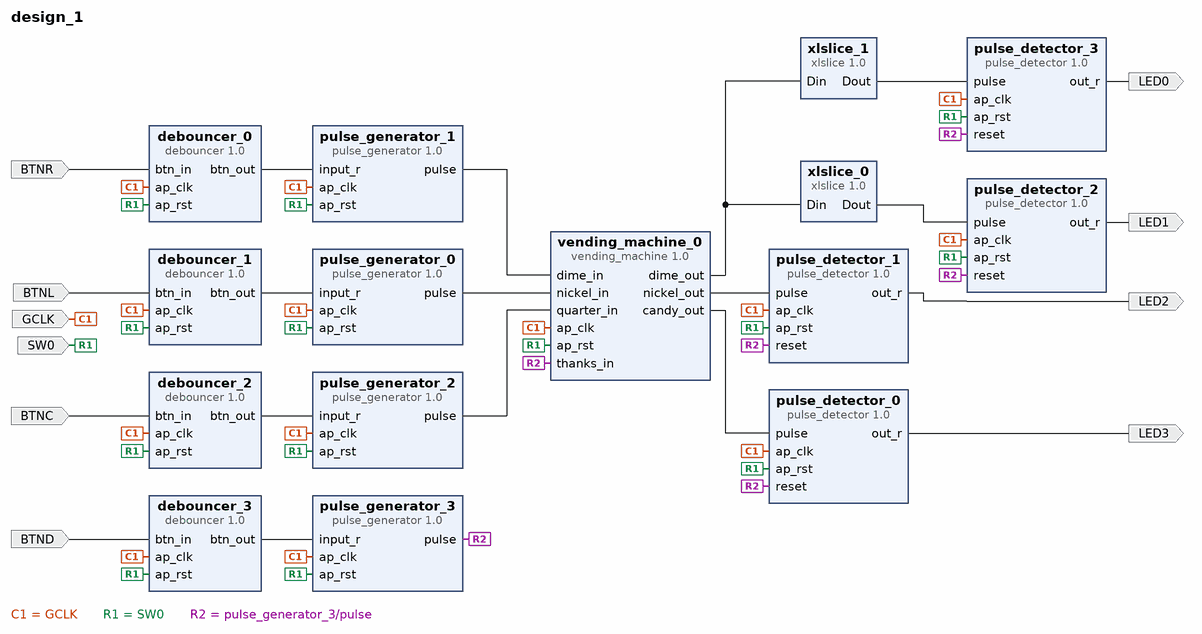
[diagram p0: block diagram of the top level]
# Vivado block design design_1, xc7z020clg484-1, Vivado 2024.1
create_bd_design design_1

create_bd_port -dir I -type clk GCLK
create_bd_port -dir I -type rst SW0
set_property -dict {CONFIG.POLARITY ACTIVE_HIGH} [get_bd_ports SW0]
create_bd_port -dir I -type data BTNL
create_bd_port -dir I -type data BTNR
create_bd_port -dir I -type data BTNC
create_bd_port -dir I -type data BTND
create_bd_port -dir O -type data LED3
create_bd_port -dir O -type data LED2
create_bd_port -dir O -type data LED1
create_bd_port -dir O -type data LED0

create_bd_cell -type ip -vlnv xilinx.com:hls:vending_machine:1.0 vending_machine_0
create_bd_cell -type ip -vlnv xilinx.com:hls:pulse_generator:1.0 pulse_generator_0
create_bd_cell -type ip -vlnv xilinx.com:hls:pulse_generator:1.0 pulse_generator_1
create_bd_cell -type ip -vlnv xilinx.com:hls:pulse_generator:1.0 pulse_generator_2
create_bd_cell -type ip -vlnv xilinx.com:hls:pulse_generator:1.0 pulse_generator_3
create_bd_cell -type ip -vlnv xilinx.com:hls:pulse_detector:1.0 pulse_detector_0
create_bd_cell -type ip -vlnv xilinx.com:hls:pulse_detector:1.0 pulse_detector_1
create_bd_cell -type ip -vlnv xilinx.com:hls:pulse_detector:1.0 pulse_detector_2
create_bd_cell -type ip -vlnv xilinx.com:hls:pulse_detector:1.0 pulse_detector_3
create_bd_cell -type ip -vlnv xilinx.com:ip:xlslice:1.0 xlslice_0
create_bd_cell -type ip -vlnv xilinx.com:ip:xlslice:1.0 xlslice_1
create_bd_cell -type ip -vlnv xilinx.com:hls:debouncer:1.0 debouncer_0
create_bd_cell -type ip -vlnv xilinx.com:hls:debouncer:1.0 debouncer_1
create_bd_cell -type ip -vlnv xilinx.com:hls:debouncer:1.0 debouncer_2
create_bd_cell -type ip -vlnv xilinx.com:hls:debouncer:1.0 debouncer_3

# ---- connections ----

connect_bd_net [get_bd_ports BTNC] [get_bd_pins debouncer_2/btn_in]
connect_bd_net [get_bd_ports BTND] [get_bd_pins debouncer_3/btn_in]
connect_bd_net [get_bd_ports BTNL] [get_bd_pins debouncer_1/btn_in]
connect_bd_net [get_bd_ports BTNR] [get_bd_pins debouncer_0/btn_in]
connect_bd_net -net ap_clk_0_1 [get_bd_ports GCLK] \
  [get_bd_pins pulse_generator_0/ap_clk] [get_bd_pins pulse_generator_1/ap_clk] [get_bd_pins pulse_generator_2/ap_clk] \
  [get_bd_pins pulse_generator_3/ap_clk] [get_bd_pins pulse_detector_0/ap_clk] [get_bd_pins pulse_detector_1/ap_clk] \
  [get_bd_pins pulse_detector_2/ap_clk] [get_bd_pins pulse_detector_3/ap_clk] [get_bd_pins vending_machine_0/ap_clk] \
  [get_bd_pins debouncer_0/ap_clk] [get_bd_pins debouncer_1/ap_clk] [get_bd_pins debouncer_2/ap_clk] \
  [get_bd_pins debouncer_3/ap_clk]
connect_bd_net -net ap_rst_0_1 [get_bd_ports SW0] \
  [get_bd_pins pulse_generator_0/ap_rst] [get_bd_pins pulse_generator_1/ap_rst] [get_bd_pins pulse_generator_2/ap_rst] \
  [get_bd_pins pulse_generator_3/ap_rst] [get_bd_pins pulse_detector_0/ap_rst] [get_bd_pins pulse_detector_1/ap_rst] \
  [get_bd_pins pulse_detector_2/ap_rst] [get_bd_pins pulse_detector_3/ap_rst] [get_bd_pins vending_machine_0/ap_rst] \
  [get_bd_pins debouncer_0/ap_rst] [get_bd_pins debouncer_1/ap_rst] [get_bd_pins debouncer_2/ap_rst] \
  [get_bd_pins debouncer_3/ap_rst]
connect_bd_net [get_bd_pins debouncer_0/btn_out] [get_bd_pins pulse_generator_1/input_r]
connect_bd_net [get_bd_pins debouncer_1/btn_out] [get_bd_pins pulse_generator_0/input_r]
connect_bd_net [get_bd_pins debouncer_2/btn_out] [get_bd_pins pulse_generator_2/input_r]
connect_bd_net [get_bd_pins debouncer_3/btn_out] [get_bd_pins pulse_generator_3/input_r]
connect_bd_net [get_bd_pins pulse_detector_0/out_r] [get_bd_ports LED3]
connect_bd_net [get_bd_pins pulse_detector_1/out_r] [get_bd_ports LED2]
connect_bd_net [get_bd_pins pulse_detector_2/out_r] [get_bd_ports LED1]
connect_bd_net [get_bd_pins pulse_detector_3/out_r] [get_bd_ports LED0]
connect_bd_net [get_bd_pins pulse_generator_0/pulse] [get_bd_pins vending_machine_0/nickel_in]
connect_bd_net [get_bd_pins pulse_generator_1/pulse] [get_bd_pins vending_machine_0/dime_in]
connect_bd_net [get_bd_pins pulse_generator_2/pulse] [get_bd_pins vending_machine_0/quarter_in]
connect_bd_net [get_bd_pins pulse_generator_3/pulse] \
  [get_bd_pins pulse_detector_3/reset] [get_bd_pins pulse_detector_2/reset] [get_bd_pins pulse_detector_1/reset] \
  [get_bd_pins pulse_detector_0/reset] [get_bd_pins vending_machine_0/thanks_in]
connect_bd_net [get_bd_pins vending_machine_0/candy_out] [get_bd_pins pulse_detector_0/pulse]
connect_bd_net [get_bd_pins vending_machine_0/dime_out] [get_bd_pins xlslice_0/Din] [get_bd_pins xlslice_1/Din]
connect_bd_net [get_bd_pins vending_machine_0/nickel_out] [get_bd_pins pulse_detector_1/pulse]
connect_bd_net [get_bd_pins xlslice_0/Dout] [get_bd_pins pulse_detector_2/pulse]
connect_bd_net [get_bd_pins xlslice_1/Dout] [get_bd_pins pulse_detector_3/pulse]

validate_bd_design
save_bd_design
